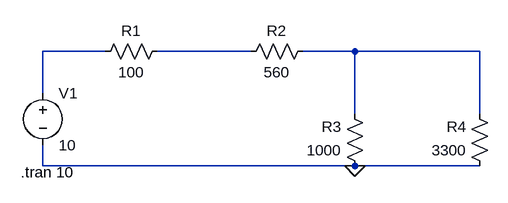
[diagram p0: schematic kcl kvl.asc]
kcl kvl.asc, the LTspice schematic file:
Version 4
SHEET 1 880 680
WIRE 176 48 80 48
WIRE 400 48 256 48
WIRE 560 48 480 48
WIRE 752 48 560 48
WIRE 80 112 80 48
WIRE 560 144 560 48
WIRE 752 144 752 48
WIRE 80 224 80 192
WIRE 560 224 80 224
WIRE 752 224 560 224
FLAG 560 224 0
SYMBOL voltage 80 96 R0
SYMATTR InstName V1
SYMATTR Value 10
SYMBOL res 272 32 R90
WINDOW 0 0 56 VBottom 2
WINDOW 3 32 56 VTop 2
SYMATTR InstName R1
SYMATTR Value 100
SYMBOL res 496 32 R90
WINDOW 0 0 56 VBottom 2
WINDOW 3 32 56 VTop 2
SYMATTR InstName R2
SYMATTR Value 560
SYMBOL res 576 240 R180
WINDOW 0 36 76 Left 2
WINDOW 3 36 40 Left 2
SYMATTR InstName R3
SYMATTR Value 1000
SYMBOL res 768 240 R180
WINDOW 0 36 76 Left 2
WINDOW 3 36 40 Left 2
SYMATTR InstName R4
SYMATTR Value 3300
TEXT 46 234 Left 2 !.tran 10

The netlist it stands for:
* kcl kvl.asc
V1 N001 0 10
R1 N002 N001 100
R2 N003 N002 560
R3 0 N003 1000
R4 0 N003 3300
.tran 10
.backanno
.end